# EAGLE schematic v1_schematic (EAGLE 9.0.1)
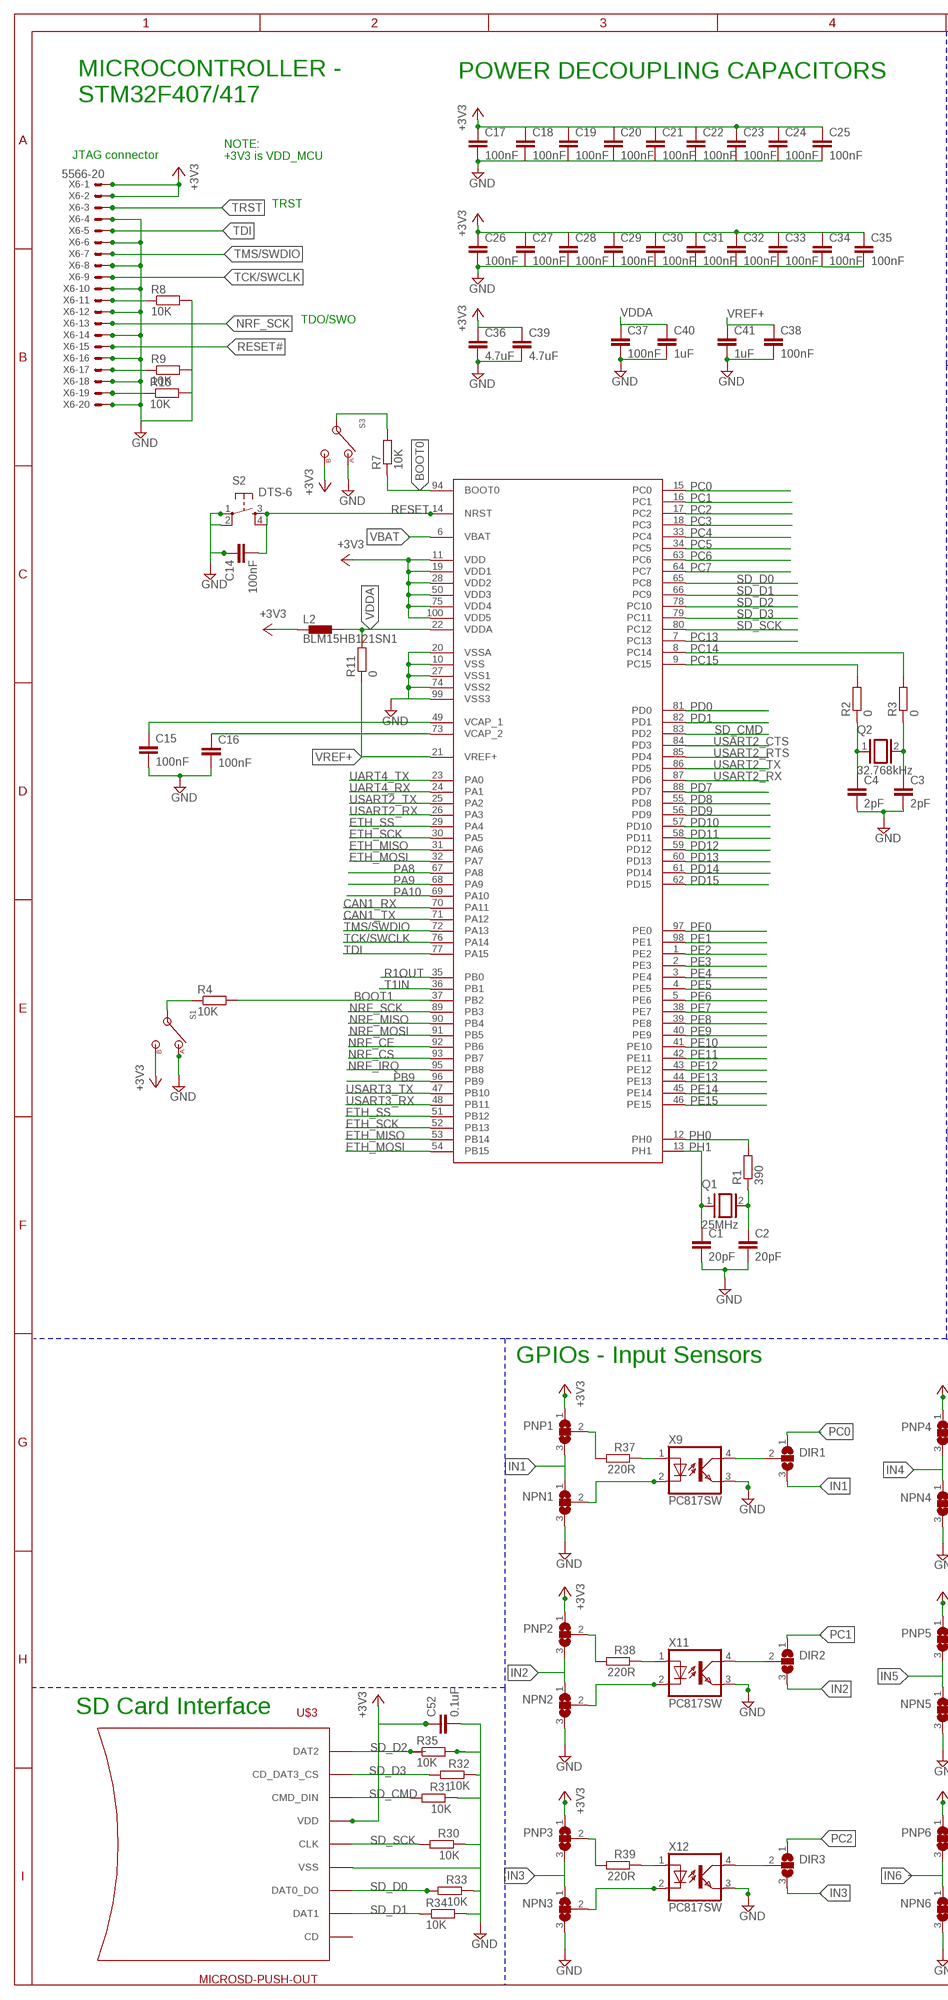
[diagram p0: schematic, sheet 1, part 1 of 2]
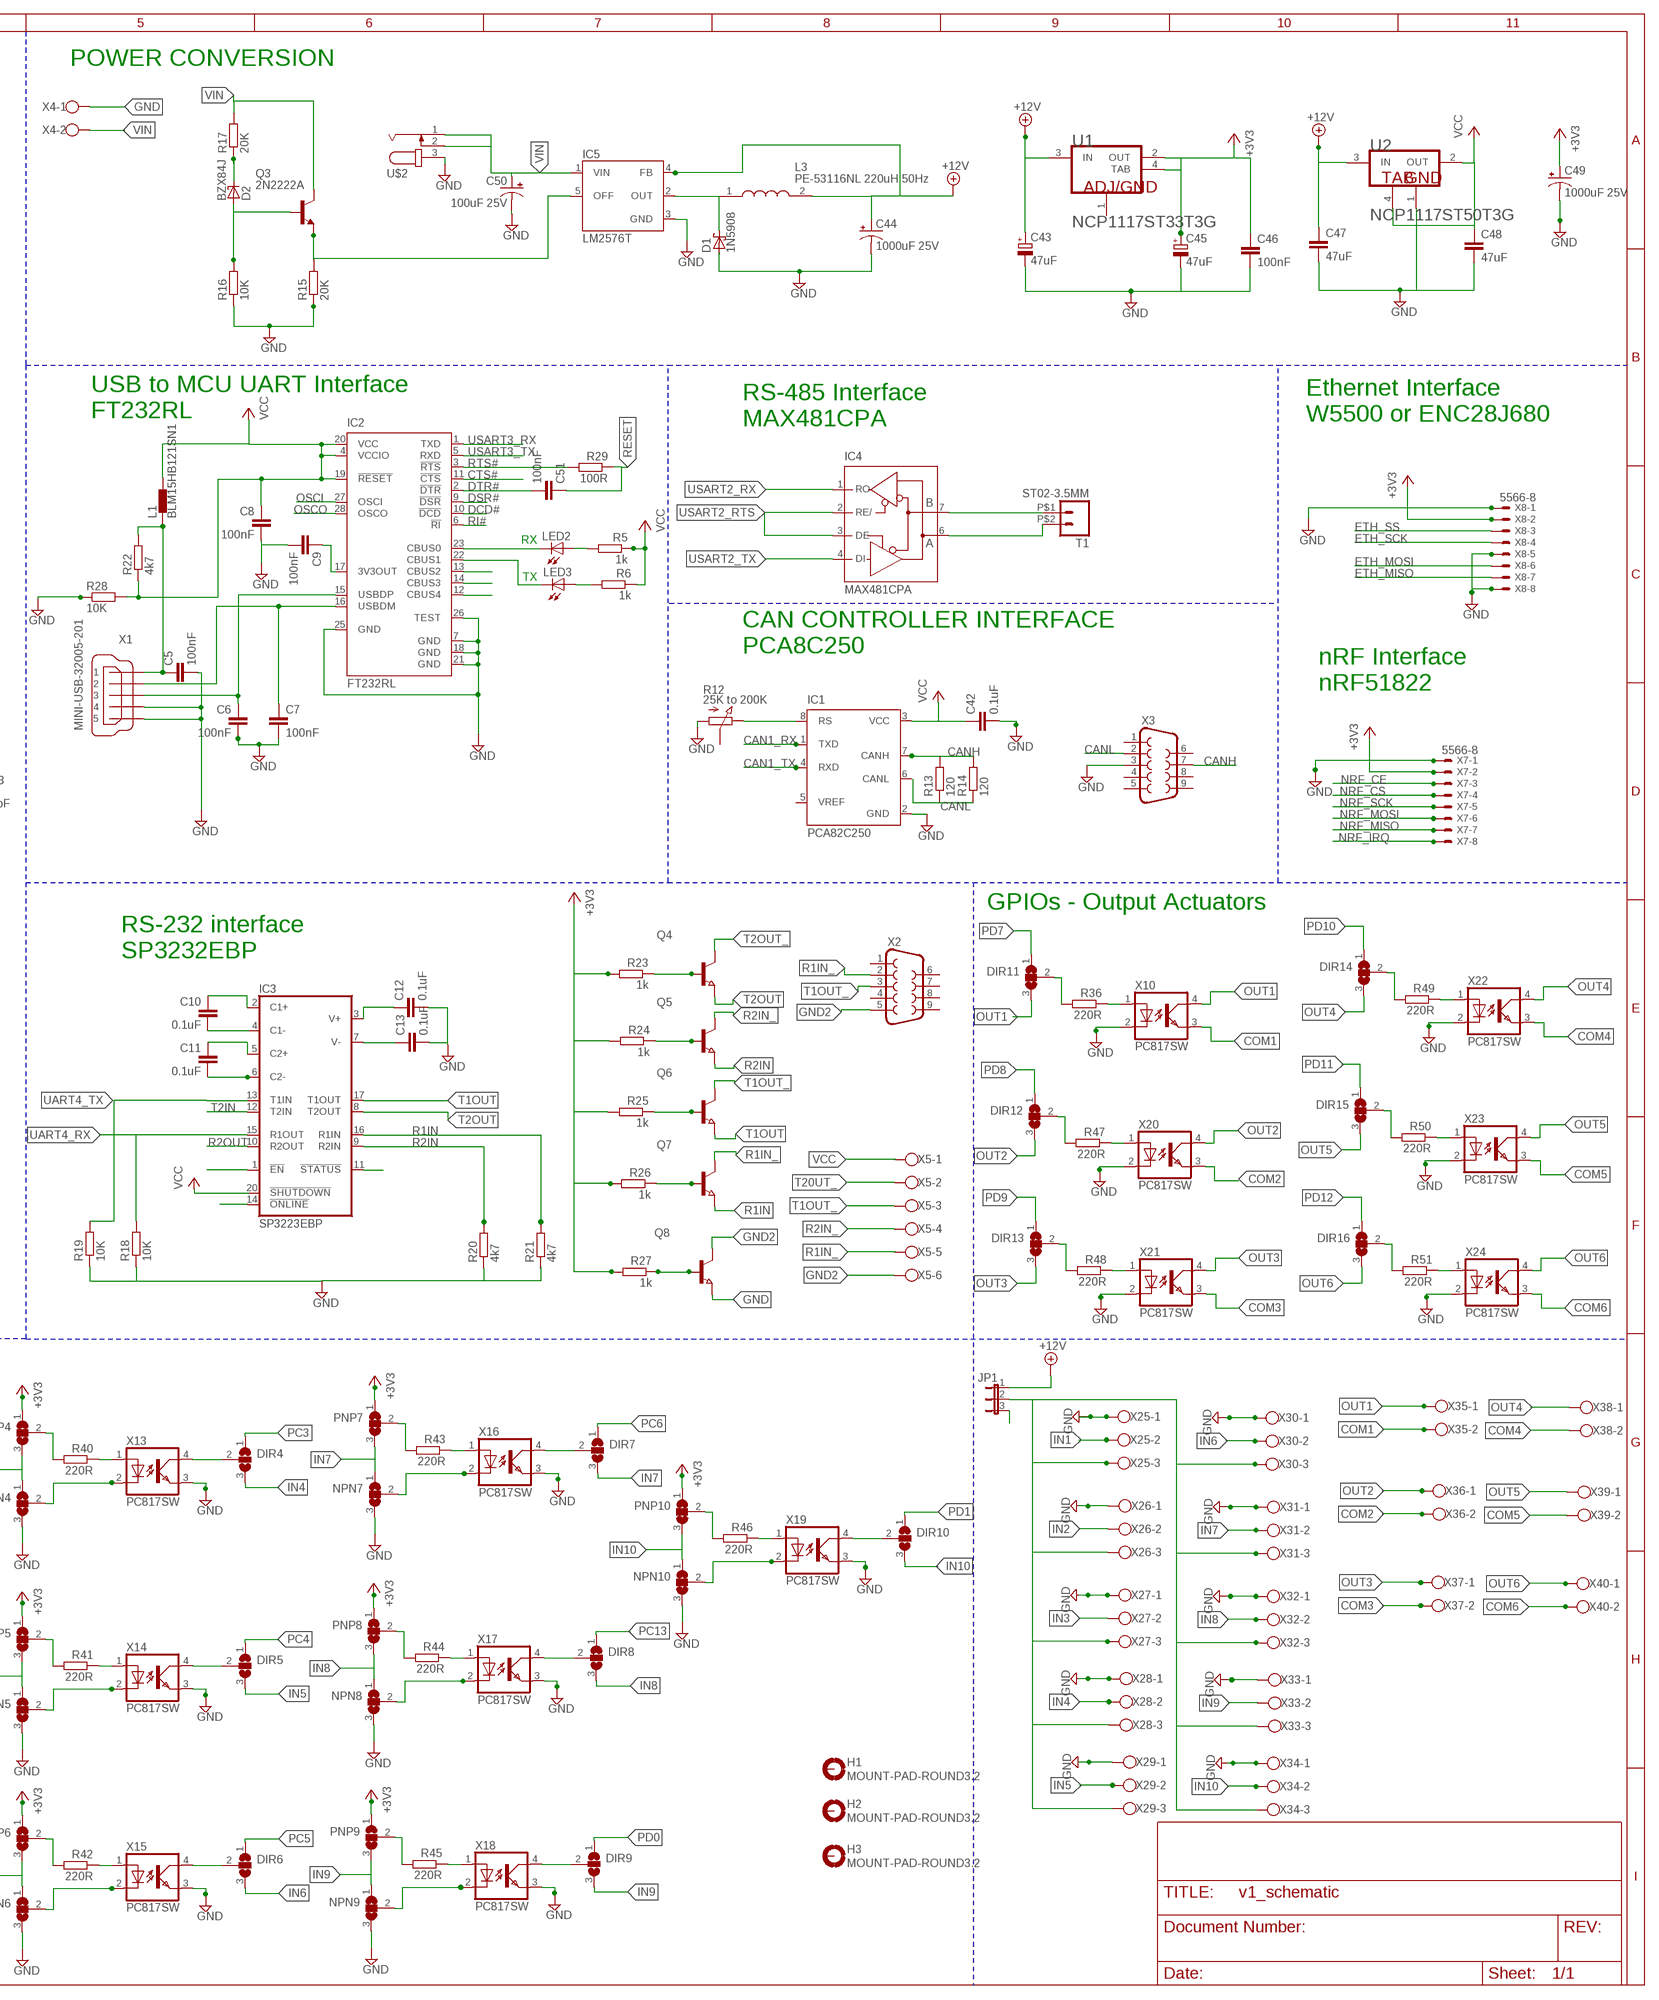
[diagram p1: schematic, sheet 1, part 2 of 2]

## Parts
C1  20pF  C-EUC0805  [C0805]
C2  20pF  C-EUC0805  [C0805]
C3  2pF  C-EUC0805  [C0805]
C4  2pF  C-EUC0805  [C0805]
C5  100nF  C-EUC0805  [C0805]
C6  100nF  C-EUC0805  [C0805]
C7  100nF  C-EUC0805  [C0805]
C8  100nF  C-EUC0805  [C0805]
C9  100nF  C-EUC0805  [C0805]
C10  0.1uF  C-EUC0805  [C0805]
C11  0.1uF  C-EUC0805  [C0805]
C12  0.1uF  C-EUC0805  [C0805]
C13  0.1uF  C-EUC0805  [C0805]
C14  100nF  C-EUC0805  [C0805]
C15  100nF  C-EUC0805  [C0805]
C16  100nF  C-EUC0805  [C0805]
C17  100nF  C-EUC0805  [C0805]
C18  100nF  C-EUC0805  [C0805]
C19  100nF  C-EUC0805  [C0805]
C20  100nF  C-EUC0805  [C0805]
C21  100nF  C-EUC0805  [C0805]
C22  100nF  C-EUC0805  [C0805]
C23  100nF  C-EUC0805  [C0805]
C24  100nF  C-EUC0805  [C0805]
C25  100nF  C-EUC0805  [C0805]
C26  100nF  C-EUC0805  [C0805]
C27  100nF  C-EUC0805  [C0805]
C28  100nF  C-EUC0805  [C0805]
C29  100nF  C-EUC0805  [C0805]
C30  100nF  C-EUC0805  [C0805]
C31  100nF  C-EUC0805  [C0805]
C32  100nF  C-EUC0805  [C0805]
C33  100nF  C-EUC0805  [C0805]
C34  100nF  C-EUC0805  [C0805]
C35  100nF  C-EUC0805  [C0805]
C36  4.7uF  C-EUC0805  [C0805]
C37  100nF  C-EUC0805  [C0805]
C38  100nF  C-EUC0805  [C0805]
C39  4.7uF  C-EUC0805  [C0805]
C40  1uF  C-EUC0805  [C0805]
C41  1uF  C-EUC0805  [C0805]
C42  0.1uF  C-EUC0805  [C0805]
C43  47uF  CPOL-EU153CLV-1014  [153CLV-1014]
C44  1000uF 25V  CPOL-USE5-6  [E5-6]
C45  47uF  CPOL-EU153CLV-1014  [153CLV-1014]
C46  100nF  CAP0603-CAP  [0603-CAP]
C47  47uF  CAP0603-CAP  [0603-CAP]
C48  47uF  CAP0603-CAP  [0603-CAP]
C49  1000uF 25V  CPOL-USE5-6  [E5-6]
C50  100uF 25V  CPOL-USE5-6  [E5-6]
C51  100nF  C-EUC0805  [C0805]
C52  0.1uF  C-EUC0805  [C0805]
D1  1N5908  [C4111-15]
D2  BZX84J  [SOD323(F)]
DIR1  SJ2WW  [SJ_2W]
DIR2  SJ2WW  [SJ_2W]
DIR3  SJ2WW  [SJ_2W]
DIR4  SJ2WW  [SJ_2W]
DIR5  SJ2WW  [SJ_2W]
DIR6  SJ2WW  [SJ_2W]
DIR7  SJ2WW  [SJ_2W]
DIR8  SJ2WW  [SJ_2W]
DIR9  SJ2WW  [SJ_2W]
DIR10  SJ2WW  [SJ_2W]
DIR11  SJ2WW  [SJ_2W]
DIR12  SJ2WW  [SJ_2W]
DIR13  SJ2WW  [SJ_2W]
DIR14  SJ2WW  [SJ_2W]
DIR15  SJ2WW  [SJ_2W]
DIR16  SJ2WW  [SJ_2W]
H1  MOUNT-PAD-ROUND3.2  [3,2-PAD]
H2  MOUNT-PAD-ROUND3.2  [3,2-PAD]
H3  MOUNT-PAD-ROUND3.2  [3,2-PAD]
IC1  PCA82C250  [DIL08]
IC2  FT232RL  [SSOP28]
IC3  SP3223EBP  [DIL20]
IC4  MAX481CPA  [DIL08]
IC5  LM2576T  [TO220-5]
JP1  JP2W  [JP2W]
L1  BLM15HB121SN1  [0402]
L2  BLM15HB121SN1  [0402]
L3  PE-53116NL 220uH 50Hz  PE-53116NL  [PE-53116NL]
LED2  LEDSML0805  [SML0805]
LED3  LEDSML0805  [SML0805]
NPN1  SJ2WW  [SJ_2W]
NPN2  SJ2WW  [SJ_2W]
NPN3  SJ2WW  [SJ_2W]
NPN4  SJ2WW  [SJ_2W]
NPN5  SJ2WW  [SJ_2W]
NPN6  SJ2WW  [SJ_2W]
NPN7  SJ2WW  [SJ_2W]
NPN8  SJ2WW  [SJ_2W]
NPN9  SJ2WW  [SJ_2W]
NPN10  SJ2WW  [SJ_2W]
PNP1  SJ2WW  [SJ_2W]
PNP2  SJ2WW  [SJ_2W]
PNP3  SJ2WW  [SJ_2W]
PNP4  SJ2WW  [SJ_2W]
PNP5  SJ2WW  [SJ_2W]
PNP6  SJ2WW  [SJ_2W]
PNP7  SJ2WW  [SJ_2W]
PNP8  SJ2WW  [SJ_2W]
PNP9  SJ2WW  [SJ_2W]
PNP10  SJ2WW  [SJ_2W]
Q1  25MHz  XTAL/S  [QS]
Q2  32.768kHz  XTAL/S  [QS]
Q3  2N2222A  [TO18]
Q4  NPN-TRANSISTOR_SOT23  [SOT23]
Q5  NPN-TRANSISTOR_SOT23  [SOT23]
Q6  NPN-TRANSISTOR_SOT23  [SOT23]
Q7  NPN-TRANSISTOR_SOT23  [SOT23]
Q8  NPN-TRANSISTOR_SOT23  [SOT23]
R1  390  R-EU_R0805  [R0805]
R2  0  R-EU_R0805  [R0805]
R3  0  R-EU_R0805  [R0805]
R4  10K  R-EU_R0805  [R0805]
R5  1k  R-EU_R0805  [R0805]
R6  1k  R-EU_R0805  [R0805]
R7  10K  R-EU_R0805  [R0805]
R8  10K  R-EU_R0805  [R0805]
R9  10K  R-EU_R0805  [R0805]
R10  10K  R-EU_R0805  [R0805]
R11  0  R-EU_R0805  [R0805]
R12  25K to 200K  PC25  [PC25]
R13  120  R-EU_R0805  [R0805]
R14  120  R-EU_R0805  [R0805]
R15  20K  R-EU_R0805  [R0805]
R16  10K  R-EU_R0805  [R0805]
R17  20K  R-EU_R0805  [R0805]
R18  10K  R-EU_R0805  [R0805]
R19  10K  R-EU_R0805  [R0805]
R20  4k7  R-EU_R0805  [R0805]
R21  4k7  R-EU_R0805  [R0805]
R22  4k7  R-EU_R0805  [R0805]
R23  1k  R-EU_R0805  [R0805]
R24  1k  R-EU_R0805  [R0805]
R25  1k  R-EU_R0805  [R0805]
R26  1k  R-EU_R0805  [R0805]
R27  1k  R-EU_R0805  [R0805]
R28  10K  R-EU_R0805  [R0805]
R29  100R  R-EU_R0805  [R0805]
R30  10K  R-EU_R0805  [R0805]
R31  10K  R-EU_R0805  [R0805]
R32  10K  R-EU_R0805  [R0805]
R33  10K  R-EU_R0805  [R0805]
R34  10K  R-EU_R0805  [R0805]
R35  10K  R-EU_R0805  [R0805]
R36  220R  R-EU_R0805  [R0805]
R37  220R  R-EU_R0805  [R0805]
R38  220R  R-EU_R0805  [R0805]
R39  220R  R-EU_R0805  [R0805]
R40  220R  R-EU_R0805  [R0805]
R41  220R  R-EU_R0805  [R0805]
R42  220R  R-EU_R0805  [R0805]
R43  220R  R-EU_R0805  [R0805]
R44  220R  R-EU_R0805  [R0805]
R45  220R  R-EU_R0805  [R0805]
R46  220R  R-EU_R0805  [R0805]
R47  220R  R-EU_R0805  [R0805]
R48  220R  R-EU_R0805  [R0805]
R49  220R  R-EU_R0805  [R0805]
R50  220R  R-EU_R0805  [R0805]
R51  220R  R-EU_R0805  [R0805]
S1  STS121PC04  [STS121PC04]
S2  DTS-6  [DTS-6]
S3  STS121PC04  [STS121PC04]
T1  ST02-3.5MM  [ED350V-02P]
U1  ON_SEMICONDUCTOR_NCP1117ST33T3GON_SEMICONDUCTOR_NCP1117ST33T3G_0_0  [ON_SEMICONDUCTOR_NCP1117ST33T3G_0]
U2  ON_SEMICONDUCTOR_NCP1117ST50T3GON_SEMICONDUCTOR_NCP1117ST50T3G_0_2  [ON_SEMICONDUCTOR_NCP1117ST50T3G_2]
U$1  STM32F40XSTM32D40X  [LQFP100]
U$2  JACK-PLUG1  [SPC4078]
U$3  MICROSD-PUSH-OUT  [MICROSD-PUSH-OUT]
X1  MINI-USB-32005-201  [32005-201]
X2  F09VB  [F09VB]
X3  F09VB  [F09VB]
X4  W237-102  [W237-102]
X5  W237-6  [W237-6]
X6  5566-20  [5566-20]
X7  5566-8  [5566-8]
X8  5566-8  [5566-8]
X9  PC817SW  [PC817SMTW]
X10  PC817SW  [PC817SMTW]
X11  PC817SW  [PC817SMTW]
X12  PC817SW  [PC817SMTW]
X13  PC817SW  [PC817SMTW]
X14  PC817SW  [PC817SMTW]
X15  PC817SW  [PC817SMTW]
X16  PC817SW  [PC817SMTW]
X17  PC817SW  [PC817SMTW]
X18  PC817SW  [PC817SMTW]
X19  PC817SW  [PC817SMTW]
X20  PC817SW  [PC817SMTW]
X21  PC817SW  [PC817SMTW]
X22  PC817SW  [PC817SMTW]
X23  PC817SW  [PC817SMTW]
X24  PC817SW  [PC817SMTW]
X25  W237-103  [W237-103]
X26  W237-103  [W237-103]
X27  W237-103  [W237-103]
X28  W237-103  [W237-103]
X29  W237-103  [W237-103]
X30  W237-103  [W237-103]
X31  W237-103  [W237-103]
X32  W237-103  [W237-103]
X33  W237-103  [W237-103]
X34  W237-103  [W237-103]
X35  W237-102  [W237-102]
X36  W237-102  [W237-102]
X37  W237-102  [W237-102]
X38  W237-102  [W237-102]
X39  W237-102  [W237-102]
X40  W237-102  [W237-102]

## Nets
+3V3: C17.1 C18.1 C19.1 C20.1 C21.1 C22.1 C23.1 C24.1 C25.1 C26.1 C27.1 C28.1 C29.1 C30.1 C31.1 C32.1 C33.1 C34.1 C35.1 C36.1 C39.1 C45.+ C46.1 C49.+ C52.1 L2.1 PNP1.1 PNP2.1 PNP3.1 PNP4.1 PNP5.1 PNP6.1 PNP7.1 PNP8.1 PNP9.1 PNP10.1 R23.2 R24.2 R25.2 R26.2 R27.2 S1.3 S3.3 U1.2(OUT) U1.4(TAB) U$1.11(VDD) U$1.19(VDD1) U$1.28(VDD2) U$1.50(VDD3) U$1.75(VDD4) U$1.100(VDD5) U$3.4(VDD) X6.1 X6.2 X7.2 X8.2
+12V: C43.+ C44.+ C47.1 IC5.4(FB) JP1.1 L3.2 U1.3(IN) U2.3(IN)
BOOT0: R7.1 U$1.94(BOOT0)
BOOT1: R4.2 U$1.37(PB2)
CAN1_RX: IC1.1(TXD) U$1.70(PA11)
CAN1_TX: IC1.4(RXD) U$1.71(PA12)
CANH: IC1.7(CANH) R13.2 R14.2 X3.7
CANL: R13.1 R14.1 X3.2
COM1: X10.3(EMIT) X35.2
COM2: X20.3(EMIT) X36.2
COM3: X21.3(EMIT) X37.2
COM4: X22.3(EMIT) X38.2
COM5: X23.3(EMIT) X39.2
COM6: X24.3(EMIT) X40.2
CTS#: IC2.11(!CTS)
DCD#: IC2.10(!DCD)
DSR#: IC2.9(!DSR)
DTR#: C51.2 IC2.2(!DTR)
ETH_MISO: U$1.31(PA6) U$1.53(PB14) X8.7
ETH_MOSI: U$1.32(PA7) U$1.54(PB15) X8.6
ETH_SCK: U$1.30(PA5) U$1.52(PB13) X8.4
ETH_SS: U$1.29(PA4) U$1.51(PB12) X8.3
GND: C1.2 C2.2 C3.2 C4.2 C5.2 C6.2 C7.2 C8.2 C9.2 C12.2 C13.2 C14.1 C15.2 C16.2 C17.2 C18.2 C19.2 C20.2 C21.2 C22.2 C23.2 C24.2 C25.2 C26.2 C27.2 C28.2 C29.2 C30.2 C31.2 C32.2 C33.2 C34.2 C35.2 C36.2 C37.2 C38.2 C39.2 C40.2 C41.2 C42.2 C43.- C44.- C45.- C46.2 C47.2 C48.2 C49.- C50.- C52.2 D1.A IC1.2(GND) IC2.7(GND) IC2.18(GND) IC2.21(GND) IC2.25(GND) IC2.26(TEST) IC5.3(GND) NPN1.3 NPN2.3 NPN3.3 NPN4.3 NPN5.3 NPN6.3 NPN7.3 NPN8.3 NPN9.3 NPN10.3 Q8.2(E) R8.2 R9.2 R10.2 R12.A R15.1 R16.1 R18.1 R19.1 R20.1 R21.1 R28.1 R30.1 R31.1 R32.1 R33.1 R34.2 R35.2 S1.1 S2.1 S2.2 S3.1 U2.1(GND) U$1.10(VSS) U$1.20(VSSA) U$1.27(VSS1) U$1.74(VSS2) U$1.99(VSS3) U$2.3 U$3.6(VSS) U$3.G1(VSS) U$3.G2(VSS) U$3.G3(VSS) U$3.G4(VSS) X1.4 X1.5 X3.3 X4.1 X6.4 X6.6 X6.8 X6.10 X6.12 X6.14 X6.16 X6.18 X6.20 X7.1 X8.1 X8.5 X8.8 X9.3(EMIT) X10.2(C) X11.3(EMIT) X12.3(EMIT) X13.3(EMIT) X14.3(EMIT) X15.3(EMIT) X16.3(EMIT) X17.3(EMIT) X18.3(EMIT) X19.3(EMIT) X20.2(C) X21.2(C) X22.2(C) X23.2(C) X24.2(C) X25.1 X26.1 X27.1 X28.1 X29.1 X30.1 X31.1 X32.1 X33.1 X34.1
GND2: Q8.3(C) X2.5 X5.6
IN1: DIR1.3 NPN1.1 PNP1.3 X25.2
IN2: DIR2.3 NPN2.1 PNP2.3 X26.2
IN3: DIR3.3 NPN3.1 PNP3.3 X27.2
IN4: DIR4.3 NPN4.1 PNP4.3 X28.2
IN5: DIR5.3 NPN5.1 PNP5.3 X29.2
IN6: DIR6.3 NPN6.1 PNP6.3 X30.2
IN7: DIR7.3 NPN7.1 PNP7.3 X31.2
IN8: DIR8.3 NPN8.1 PNP8.3 X32.2
IN9: DIR9.3 NPN9.1 PNP9.3 X33.2
IN10: DIR10.3 NPN10.1 PNP10.3 X34.2
N$1: PNP1.2 R37.2
N$2: C15.1 U$1.49(VCAP_1)
N$3: C2.1 Q1.2 R1.1
N$4: C5.1 L1.1 R22.2 X1.1
N$7: C3.1 Q2.2 R3.1
N$8: C4.1 Q2.1 R2.1
N$9: C9.1 IC2.17(3V3OUT)
N$10: IC2.13(CBUS2)
N$11: R4.1 S1.2
N$12: C7.1 IC2.16(USBDM) X1.2
N$13: C6.1 IC2.15(USBDP) X1.3
N$14: IC2.23(CBUS0) LED2.C
N$15: IC2.22(CBUS1) LED3.C
N$16: LED3.A R6.2
N$17: LED2.A R5.2
N$18: C10.2 IC3.4(C1-)
N$19: C11.2 IC3.6(C2-)
N$20: C11.1 IC3.5(C2+)
N$21: C10.1 IC3.2(C1+)
N$22: C13.1 IC3.7(V-)
N$23: C12.1 IC3.3(V+)
N$24: C14.2 S2.3 S2.4
N$25: R7.2 S3.2
N$27: IC4.7(B) T1.P$1
N$28: IC1.8(RS) R12.E
N$29: IC4.6(A) T1.P$2
N$30: D2.2(A) Q3.2(B) R16.2
N$31: R37.1 X9.1(A)
N$32: Q3.1(E) R15.2
N$33: NPN1.2 X9.2(C)
N$35: D2.1(C) R17.1
N$36: IC5.5(OFF)
N$37: JP1.3
N$38: JP1.2 X25.3 X26.3 X27.3 X28.3 X29.3 X30.3 X31.3 X32.3 X33.3 X34.3
N$39: PNP8.2 R44.2
N$40: C16.1 U$1.73(VCAP_2)
N$41: D1.C IC5.2(OUT) L3.1
N$42: IC2.14(CBUS3)
N$43: IC3.1(!EN)
N$44: IC3.14(!ONLINE)
N$45: IC3.11(!STATUS)
N$46: IC2.12(CBUS4)
N$47: DIR1.2 X9.4(COL)
N$48: R44.1 X17.1(A)
N$49: Q4.1(B) R23.1
N$50: R8.1 X6.11
N$51: Q5.1(B) R24.1
N$52: Q6.1(B) R25.1
N$53: R9.1 X6.17
N$54: Q7.1(B) R26.1
N$55: Q8.1(B) R27.1
N$56: R10.1 X6.19
N$59: DIR11.2 R36.2
N$60: R36.1 X10.1(A)
N$61: DIR12.2 R47.2
N$66: PNP2.2 R38.2
N$67: R38.1 X11.1(A)
N$68: NPN2.2 X11.2(C)
N$71: NPN8.2 X17.2(C)
N$72: DIR2.2 X11.4(COL)
N$76: PNP3.2 R39.2
N$77: R39.1 X12.1(A)
N$78: NPN3.2 X12.2(C)
N$82: DIR3.2 X12.4(COL)
N$83: DIR8.2 X17.4(COL)
N$86: PNP4.2 R40.2
N$87: R40.1 X13.1(A)
N$88: NPN4.2 X13.2(C)
N$92: DIR4.2 X13.4(COL)
N$96: PNP5.2 R41.2
N$97: R41.1 X14.1(A)
N$98: NPN5.2 X14.2(C)
N$101: PNP9.2 R45.2
N$102: DIR5.2 X14.4(COL)
N$103: R45.1 X18.1(A)
N$106: PNP6.2 R42.2
N$107: R42.1 X15.1(A)
N$108: NPN6.2 X15.2(C)
N$111: NPN9.2 X18.2(C)
N$112: DIR6.2 X15.4(COL)
N$116: PNP7.2 R43.2
N$117: R43.1 X16.1(A)
N$118: NPN7.2 X16.2(C)
N$122: DIR7.2 X16.4(COL)
N$123: DIR9.2 X18.4(COL)
N$128: PNP10.2 R46.2
N$129: R46.1 X19.1(A)
N$130: NPN10.2 X19.2(C)
N$133: DIR10.2 X19.4(COL)
N$136: R47.1 X20.1(A)
N$141: DIR13.2 R48.2
N$142: R48.1 X21.1(A)
N$147: DIR14.2 R49.2
N$148: R49.1 X22.1(A)
N$153: DIR15.2 R50.2
N$154: R50.1 X23.1(A)
N$159: DIR16.2 R51.2
N$160: R51.1 X24.1(A)
NRF_CE: U$1.92(PB6) X7.3
NRF_CS: U$1.93(PB7) X7.4
NRF_IRQ: U$1.95(PB8) X7.8
NRF_MISO: U$1.90(PB4) X7.7
NRF_MOSI: U$1.91(PB5) X7.6
NRF_SCK: U$1.89(PB3) X6.13 X7.5
OSCI: IC2.27(OSCI)
OSCO: IC2.28(OSCO)
OUT1: DIR11.3 X10.4(COL) X35.1
OUT2: DIR12.3 X20.4(COL) X36.1
OUT3: DIR13.3 X21.4(COL) X37.1
OUT4: DIR14.3 X22.4(COL) X38.1
OUT5: DIR15.3 X23.4(COL) X39.1
OUT6: DIR16.3 X24.4(COL) X40.1
PA8: U$1.67(PA8)
PA9: U$1.68(PA9)
PA10: U$1.69(PA10)
PB9: U$1.96(PB9)
PC0: DIR1.1 U$1.15(PC0)
PC1: DIR2.1 U$1.16(PC1)
PC2: DIR3.1 U$1.17(PC2)
PC3: DIR4.1 U$1.18(PC3)
PC4: DIR5.1 U$1.33(PC4)
PC5: DIR6.1 U$1.34(PC5)
PC6: DIR7.1 U$1.63(PC6)
PC7: U$1.64(PC7)
PC13: DIR8.1 U$1.7(PC13)
PC14: R3.2 U$1.8(PC14)
PC15: R2.2 U$1.9(PC15)
PD0: DIR9.1 U$1.81(PD0)
PD1: DIR10.1 U$1.82(PD1)
PD7: DIR11.1 U$1.88(PD7)
PD8: DIR12.1 U$1.55(PD8)
PD9: DIR13.1 U$1.56(PD9)
PD10: DIR14.1 U$1.57(PD10)
PD11: DIR15.1 U$1.58(PD11)
PD12: DIR16.1 U$1.59(PD12)
PD13: U$1.60(PD13)
PD14: U$1.61(PD14)
PD15: U$1.62(PD15)
PE0: U$1.97(PE0)
PE1: U$1.98(PE1)
PE2: U$1.1(PE2)
PE3: U$1.2(PE3)
PE4: U$1.3(PE4)
PE5: U$1.4(PE5)
PE6: U$1.5(PE6)
PE7: U$1.38(PE7)
PE8: U$1.39(PE8)
PE9: U$1.40(PE9)
PE10: U$1.41(PE10)
PE11: U$1.42(PE11)
PE12: U$1.43(PE12)
PE13: U$1.44(PE13)
PE14: U$1.45(PE14)
PE15: U$1.46(PE15)
PH0: R1.2 U$1.12(PH0)
PH1: C1.1 Q1.1 U$1.13(PH1)
R1IN: IC3.16(R1IN) Q7.2(E) R21.2
R1IN_: Q7.3(C) X2.2 X5.5
R1OUT: U$1.35(PB0)
R2IN: IC3.9(R2IN) Q5.2(E) R20.2
R2IN_: Q5.3(C) X5.4
R2OUT: IC3.10(R2OUT)
RESET: C51.1 R29.1 U$1.14(NRST)
RESET#: X6.15
RI#: IC2.6(!RI)
RTS#: IC2.3(!RTS) R29.2
SD_CMD: R31.2 U$1.83(PD2) U$3.3(CMD_DIN)
SD_D0: R33.2 U$1.65(PC8) U$3.7(DAT0_DO)
SD_D1: R34.1 U$1.66(PC9) U$3.8(DAT1)
SD_D2: R35.1 U$1.78(PC10) U$3.1(DAT2)
SD_D3: R32.2 U$1.79(PC11) U$3.2(CD_DAT3_CS)
SD_SCK: R30.2 U$1.80(PC12) U$3.5(CLK)
T1IN: U$1.36(PB1)
T1OUT: IC3.17(T1OUT) Q6.2(E)
T1OUT_: Q6.3(C) X2.3 X5.3
T2IN: IC3.12(T2IN)
T2OUT: IC3.8(T2OUT) Q4.2(E)
T2OUT_: Q4.3(C)
T20UT_: X5.2
TCK/SWCLK: U$1.76(PA14) X6.9
TDI: U$1.77(PA15) X6.5
TMS/SWDIO: U$1.72(PA13) X6.7
TRST: X6.3
UART4_RX: IC3.15(R1OUT) R18.2 U$1.24(PA1)
UART4_TX: IC3.13(T1IN) R19.2 U$1.23(PA0)
USART2_CTS: U$1.84(PD3)
USART2_RTS: IC4.2(RE/) IC4.3(DE) U$1.85(PD4)
USART2_RX: IC4.1(RO) U$1.26(PA3) U$1.87(PD6)
USART2_TX: IC4.4(DI) U$1.25(PA2) U$1.86(PD5)
USART3_RX: IC2.1(TXD) U$1.48(PB11)
USART3_TX: IC2.5(RXD) U$1.47(PB10)
VBAT: U$1.6(VBAT)
VCC: C8.1 C42.1 C48.1 IC1.3(VCC) IC2.4(VCCIO) IC2.19(!RESET) IC2.20(VCC) IC3.20(!SHUTDOWN) L1.2 R5.1 R6.1 R22.1 R28.2 U2.2(OUT) U2.4(TAB) X5.1
VDDA: C37.1 C40.1 L2.2 R11.2 U$1.22(VDDA)
VIN: C50.+ IC5.1(VIN) Q3.3(C) R17.2 U$2.1 U$2.2 X4.2
VREF+: C38.1 C41.1 R11.1 U$1.21(VREF+)
Unconnected: H1.B3,2(MOUNT) H2.B3,2(MOUNT) H3.B3,2(MOUNT) IC1.5(VREF) IC1.6(CANL) R12.S U1.1(ADJ/GND) U$3.CD X2.1 X2.4 X2.6 X2.7 X2.8 X2.9 X3.1 X3.4 X3.5 X3.6 X3.8 X3.9

## Buses
B$1
B$2

## Notes on the sheet
- POWER CONVERSION
- POWER DECOUPLING CAPACITORS
- MICROCONTROLLER - 
  STM32F407/417
- JTAG connector
- NOTE:
  +3V3 is VDD_MCU
- TRST
- TDO/SWO
- USB to MCU UART Interface 
  FT232RL
- Ethernet Interface 
  W5500 or ENC28J680
- RS-485 Interface
  MAX481CPA
- RX
- TX
- CAN CONTROLLER INTERFACE
  PCA8C250
- nRF Interface 
  nRF51822
- GPIOs - Output Actuators
- RS-232 interface
  SP3232EBP
- GPIOs - Input Sensors
- SD Card Interface

## Power pins joined to a net without a drawn wire
GND: IC3.18(GND) IC4.5(GND)
VCC: IC3.19(VCC) IC4.8(VCC)

## Library data of the parts
C1-C42 C51 C52 = resistor:C-EU: CAPACITOR, European symbol
C43 C45 = rcl:CPOL-EU: POLARIZED CAPACITOR, European symbol; SPICEPREFIX: C
C44 C49 C50 = rcl:CPOL-US: POLARIZED CAPACITOR, American symbol; SPICEPREFIX: C
C46-C48 = SparkFun-Capacitors:CAP: Capacitor Standard 0603 ceramic capacitor, and 0.1" leaded capacitor.
D1 = diode:1N5908: DIODE schottky
D2 = NXP_60_26022015:BZX84J: Single Zener diodes General-purpose Zener diodes in a SOD323F (SC-90) very small and flat lead Surface-Mounted Device (SMD) plastic package. AAL Eindhoven MK
DIR1-DIR16 NPN1-NPN10 PNP1-PNP10 = jumper:SJ2W: SMD solder JUMPER
H1-H3 = holes:MOUNT-PAD-ROUND: MOUNTING PAD, round
IC1 = micro-philips:PCA82C250: CAN CONTROLLER INTERFACE; OC_FARNELL: 3692358; OC_NEWARK: unknown
IC2 = ftdichip:FT232R: Source: http://www.ftdichip.com/Documents/DataSheets/DS_FT232R_v104.pdf; MPN: FT232RL; OC_FARNELL: 1146032; OC_NEWARK: 91K9918
IC3 = sipex:SP3223*: RS-232 Transceivers with AutoShutdown 1µA Supply-Current, True +3V to +5.5V Source: http://www.sipex.com/Files/Datasheets/SP3223.pdf (Pincompatible to Maxim MAX3223); OC_FARNELL: unknown; OC_NEWARK: unknown
IC4 = maxim:MAX481CPA: RS485 TRANSEIVER; MPN: MAX481CPA+; OC_FARNELL: unknown; OC_NEWARK: 99K3445
IC5 = v-reg-3-new:LM2576: National Semiconductor <http://www.national.com> 3.0A "Simple Switcher"(c) 52kHz, Vout 1.23-37V (HV: 57V), Vin 40V (HV: 60V), 50µA standby current
JP1 = jumper:JP2W: JUMPER
L1 L2 = inductors:BLM15H: EMIFIL (R) Chip Ferrite Bead for GHz Noise Source: http://www.murata.com/ Ferrite Bead BLM15H.pdf
L3 = PE-53116NL:PE-53116NL: Fixed Inductors 220uH 3A Source: Datasheet <https://componentsearchengine.com/Datasheets/1/PE-53116NL.pdf>; DESCRIPTION: Fixed Inductors 220uH 3A; HEIGHT: mm; MANUFACTURER_NAME: Pulse; MANUFACTURER_PART_NUMBER: PE-53116NL; MOUSER_PART_NUMBER: 673-PE-53116NL
LED2 LED3 = led:LED: LED OSRAM: - CHIPLED LG R971, LG N971, LY N971, LG Q971, LY Q971, LO R971, LY R971 LH N974, LH R974 LS Q976, LO Q976, LY Q976 LO Q996 - Hyper CHIPLED LW Q18S LB Q993, LB Q99A, LB R99A - SideLED LS A670, LO A670, LY A670, LG A670, LP A670 LB A673, LV A673, LT A673, LW A673 LH A674 LY A675 LS A676, LA A676, LO A676, LY A676, LW A676 LS A679, LY A679, LG A679 - Hyper Micro SIDELED® LS Y876, LA Y876, LO Y876, LY Y876 LT Y87S - SmartLED LW L88C, LW L88S LB L89C, LB L89S, LG L890 LS L89K, LO L89K, LY L89K LS L896, LA L896, LO L896, LY L896 - TOPLED LS T670, LO T670, LY T670, LG T670, LP T670 LSG T670, LSP T670, LSY T670, LOP T670, LYG T670 LG T671, LOG T671, LSG T671 LB T673, LV T673, LT T673, LW T673 LH T674 LS T676, LA T676, LO T676, LY T676, LB T676, LH T676, LSB T676, LW T676 LB T67C, LV T67C, LT T67C, LS T67K, LO T67K, LY T67K, LW E67C LS E67B, LA E67B, LO E67B, LY E67B, LB E67C, LV E67C, LT E67C LW T67C LS T679, LY T679, LG T679 LS T770, LO T770, LY T770, LG T770, LP T770 LB T773, LV T773, LT T773, LW T773 LH T774 LS E675, LA E675, LY E675, LS T675 LS T776, LA T776, LO T776, LY T776, LB T776 LHGB T686 LT T68C, LB T68C - Hyper Mini TOPLED® LB M676 - Mini TOPLED Santana® LG M470 LS M47K, LO M47K, LY M47K Source: http://www.osram.convergy.de LUXEON: - LUMILED® LXK2-PW12-R00, LXK2-PW12-S00, LXK2-PW14-U00, LXK2-PW14-V00 LXK2-PM12-R00, LXK2-PM12-S00, LXK2-PM14-U00 LXK2-PE12-Q00, LXK2-PE12-R00, LXK2-PE12-S00, LXK2-PE14-T00, LXK2-PE14-U00 LXK2-PB12-K00, LXK2-PB12-L00, LXK2-PB12-M00, LXK2-PB14-N00, LXK2-PB14-P00, LXK2-PB14-Q00 LXK2-PR12-L00, LXK2-PR12-M00, LXK2-PR14-Q00, LXK2-PR14-R00 LXK2-PD12-Q00, LXK2-PD12-R00, LXK2-PD12-S00 LXK2-PH12-R00, LXK2-PH12-S00 LXK2-PL12-P00, LXK2-PL12-Q00, LXK2-PL12-R00 Source: www.luxeon.com KINGBRIGHT: KA-3528ASYC Source: www.kingbright.com
Q1 Q2 = special:XTAL/S: CRYSTAL
Q3 = transistor-npn:2N2222*: NPN Transistor
Q4-Q8 = semicon-smd-ipc:NPN-TRANSISTOR_: NPN TRANSISTOR
R1-R3 R5 R6 R11 R13 R14 R23-R27 R29 = resistor:R-EU_: RESISTOR, European symbol
R4 R7-R10 R15-R22 R28 R30-R51 = rcl:R-EU_: RESISTOR, European symbol; SPICEPREFIX: R
R12 = pot-vitrohm:PC25: VITROHM POTENTIOMETER; MF: CLAROSTAT; MPN: 308NPC25KS; OC_FARNELL: 1440998; OC_NEWARK: 03F7518
S1 S3 = switches:STS121PC04: Slide Switch SPDT Through Hole; DIGIKEY: 450-1609-ND
S2 = switch-tact:DTS-6
T1 = con-dinkle:ST02: Dinkle® Screw Terminal Block - 2 Way -5MM: EK500V series. Rated at 20A, 300VAC. Cable size: 2mm² Supplier: Altronics P2034A Source: http://www.dinkle.com/upfiles/proter21253708953.pdf -5.08MM: The back half of a EK500V4R-04P. Rated at 20A, 300VAC. Cable size: 2mm² Supplier: Altronics P2024 (half of) Source: http://www.dinkle.com/upfiles/proter21253708833.pdf -3.5MM: ED350V series. Rated at 10A, 300VAC. Cable size: 1.4mm² Supplier: Altronics P2028 Source: http://www.dinkle.com/upfiles/proter21253714491.pdf
U1 = ON Semiconductor - NCP1117ST33T3G:ON_SEMICONDUCTOR_NCP1117ST33T3G: ONSC-NCP1117-SOT223-4; CASE_CODE_IMPERIAL: 0603; CASE_CODE_METRIC: 1608; CASE_PACKAGE: 0603; CIIVA_IDS: 19354120; COMPONENT_LINK_1_DESCRIPTION: Manufacturer URL; COMPONENT_LINK_1_URL: http://www.onsemi.com/; DATASHEET: http://www.onsemi.com/pub_link/Collateral/NCP1117-D.PDF; DATASHEET_VERSION: Rev. 27, 09/2014; FOOTPRINT_VARIANT_NAME_0: Manufacturer Recommended; HEIGHT: 0.45 mm; IMPORTED: yes; IMPORTED_FROM: vault; IMPORT_TS: 1521845423; LENGTH: 1.55 mm; MAX_OPERATING_TEMPERATURE: 155 degC; MF: ON Semiconductor; MIN_OPERATING_TEMPERATURE: -55 degC; MOUNT: Surface Mount; MPN: NCP1117ST33T3G; PACKAGE: SOT-223-4-318H-01_A; PACKAGE_DESCRIPTION: 4-Pin Small Outline Transistor, Body 6.5 x 3.5 mm, Pitch 2.3 mm; PACKAGE_QUANTITY: 5000; PACKAGING: Tape and Reel; POWER_RATING: 100 mW; PREFIX: U; RADIATION_HARDENING: No; REACH_SVHC: Unknown; RELEASE_DATE: 1475065185; RESISTANCE: 220 kohm; RO_HSCOMPLIANT: true; TOLERANCE: 1%; TYPE_RESISTOR: Thick Film; VAULT_GUID: C6E429D0-32F2-4CA3-9C68-29F3FC9DADEB; VAULT_REVISION: 6AD56B9F-4B97-41F2-91E8-97C557B92B31; VOLTAGE_RATING: 75 V; WEIGHT: 7.1E-05 oz; WIDTH: 0.85 mm
U2 = ON Semiconductor - NCP1117ST50T3G:ON_SEMICONDUCTOR_NCP1117ST50T3G: ONSC-NCP1117ST-TO-223-4; CIIVA_IDS: 19354121; COMPONENT_LINK_1_DESCRIPTION: Manufacturer URL; COMPONENT_LINK_1_URL: http://www.onsemi.com/; COMPONENT_LINK_3_DESCRIPTION: Package Specification; COMPONENT_LINK_3_URL: http://www.onsemi.com/pub_link/Collateral/318H-01.PDF; DATASHEET: http://www.onsemi.com/pub_link/Collateral/NCP1117-D.PDF; DATASHEET_VERSION: Rev. 26; DROPOUT_VOLTAGE: 1.2 V; FOOTPRINT_VARIANT_NAME_0: Level C; FOOTPRINT_VARIANT_NAME_1: Level B; FOOTPRINT_VARIANT_NAME_2: Level A; IMPORTED: yes; IMPORTED_FROM: vault; IMPORT_TS: 1521847243; IOUT_MIN: 1 A; IQ: 6 mA; MF: ON Semiconductor; MOUNTING_TECHNOLOGY: Surface Mount; MPN: NCP1117ST50T3G; NOMINAL_OUTPUT_VOLTAGE: 5 V; OPERATING_TEMPERATURE: 0 to 125 degC; PACKAGE: SOT-223; PACKAGE_DESCRIPTION: 4-Pin Small Out-Line Transistor, Body 3.5 x 6.5 mm, Pitch 2.3 mm; PACKING: Tape and Reel; PREFIX: U; RELEASE_DATE: 1385348949; RR: 61 dB; VAULT_GUID: CAB80007-3002-407D-8F59-BB02D59733C7; VAULT_REVISION: 987D8771-C9B4-4194-9817-534179016626; VIN: 20 V
U$1 = stm32f:STM32F40X: Features • Core: ARM 32-bit Cortex™-M4 CPU with FPU, Adaptive real-time accelerator (ART Accelerator™) allowing 0-wait state execution from Flash memory, frequency up to 168 MHz, memory protection unit, 210 DMIPS/ 1.25 DMIPS/MHz (Dhrystone 2.1), and DSP instructions • Memories – Up to 1 Mbyte of Flash memory – Up to 192+4 Kbytes of SRAM including 64- Kbyte of CCM (core coupled memory) data RAM – Flexible static memory controller supporting Compact Flash, SRAM, PSRAM, NOR and NAND memories • LCD parallel interface, 8080/6800 modes • Clock, reset and supply management – 1.8 V to 3.6 V application supply and I/Os – POR, PDR, PVD and BOR – 4-to-26 MHz crystal oscillator – Internal 16 MHz factory-trimmed RC (1% accuracy) – 32 kHz oscillator for RTC with calibration – Internal 32 kHz RC with calibration • Low power – Sleep, Stop and Standby modes – VBAT supply for RTC, 20×32 bit backup registers + optional 4 KB backup SRAM • 3×12-bit, 2.4 MSPS A/D converters: up to 24 channels and 7.2 MSPS in triple interleaved mode • 2×12-bit D/A converters • General-purpose DMA: 16-stream DMA controller with FIFOs and burst support • Up to 17 timers: up to twelve 16-bit and two 32- bit timers up to 168 MHz, each with up to 4 IC/OC/PWM or pulse counter and quadrature (incremental) encoder input • Debug mode – Serial wire debug (SWD) & JTAG interfaces – Cortex-M4 Embedded Trace Macrocell™ • Up to 140 I/O ports with interrupt capability – Up to 136 fast I/Os up to 84 MHz – Up to 138 5 V-tolerant I/Os • Up to 15 communication interfaces – Up to 3 × I2C interfaces (SMBus/PMBus) – Up to 4 USARTs/2 UARTs (10.5 Mbit/s, ISO 7816 interface, LIN, IrDA, modem control) – Up to 3 SPIs (42 Mbits/s), 2 with muxed full-duplex I2S to achieve audio class accuracy via internal audio PLL or external clock – 2 × CAN interfaces (2.0B Active) – SDIO interface • Advanced connectivity – USB 2.0 full-speed device/host/OTG controller with on-chip PHY – USB 2.0 high-speed/full-speed device/host/OTG controller with dedicated DMA, on-chip full-speed PHY and ULPI – 10/100 Ethernet MAC with dedicated DMA: supports IEEE 1588v2 hardware, MII/RMII • 8- to 14-bit parallel camera interface up to 54 Mbytes/s • True random number generator • CRC calculation unit • 96-bit unique ID • RTC: subsecond accuracy, hardware calendar
U$2 = con-jack:JACK-PLUG: DC POWER JACK Power Jack, DC, Right Angle, Through Hole, Rated 5A at 16VDC, PC Terminals Distributor: Farnell (www.Farnell.de) Drawing: 84N1161.pdf / 84N1162.pdf Manufacturer: SPC Technology (www.spctechnology.com) Type: SPC4077 / SPC 4078; OC_FARNELL: unknown; OC_NEWARK: unknown
U$3 = microsd:MICROSD-PUSH-OUT: T-Flash Push-Out Micro SD Card Reader 14.75mm x 14.5mm SMD with external pins
X1 = con-cypressindustries:MINI-USB-: MINI USB-B Conector Source: www.cypressindustries.com; OC_FARNELL: unknown; OC_NEWARK: unknown
X2 X3 = con-subd:F09: SUB-D; OC_FARNELL: unknown; OC_NEWARK: unknown
X4 X35-X40 = con-wago-500:W237-102: WAGO SCREW CLAMP; MPN: 237-102; OC_FARNELL: unknown; OC_NEWARK: 70K9898
X5 = con-wago-500:W237-6: WAGO SCREW CLAMP; OC_FARNELL: unknown; OC_NEWARK: unknown
X6 = con-molex:5566-20: Mini FIT connector 20 pol ATX PC-Motherboard Power connector Source: http://www.molex.com; MF: MOLEX; OC_FARNELL: unknown; OC_NEWARK: unknown
X7 X8 = con-molex:5566-8: Mini FIT connector 8 pol Source: http://www.molex.com; MF: MOLEX; OC_FARNELL: unknown; OC_NEWARK: unknown
X9-X24 = GadgetFactory_v1:PC817
X25-X34 = con-wago-500:W237-103: WAGO SCREW CLAMP; MPN: 237-103; OC_FARNELL: unknown; OC_NEWARK: 18M7116

## Module PE-53116NL
Ports: 

### Library data of the parts